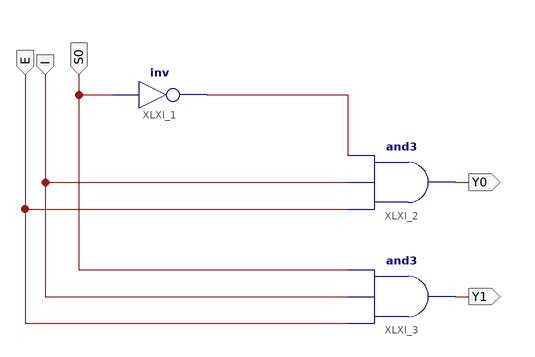
[diagram p0: schematic sheet 1]
// Xilinx ISE schematic DEMUX_1_2.sch (artix7) as structural Verilog: 3 symbols, 5 ports
module DEMUX_1_2 (
  input  S0,
  input  I,
  input  E,
  output Y0,
  output Y1
);

  wire XLXN_1;

  not XLXI_1 (XLXN_1, S0);
  and XLXI_2 (Y0, E, I, XLXN_1);
  and XLXI_3 (Y1, E, I, S0);
endmodule
